# EAGLE design Rectangular_Touch_Pad_V2.3 (EAGLE 9.5.0)
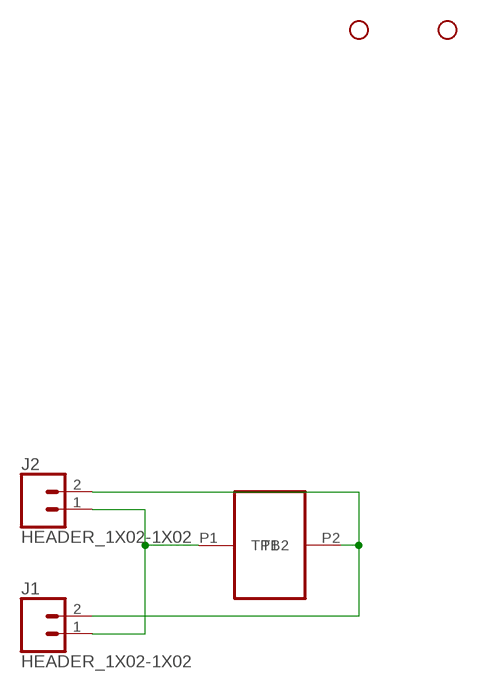
[diagram p0: schematic, sheet 1]

## Parts
H1  STAND-OFF-  [STAND-OFF]
H2  STAND-OFF-  [STAND-OFF]
J1  HEADER_1X02-1X02  [1X02]
J2  HEADER_1X02-1X02  [1X02]
U$1  TOUCHPAD-VER2.3  [TOUCHPAD-RECT-VER2.3]

## Nets
N$1: J1.1 J2.1 U$1.P1(TP1)
N$4: J1.2 J2.2 U$1.P2(TB2)

## Library data of the parts
H1 H2 = MMC Eagle:STAND-OFF-
J1 J2 = MMC Eagle:HEADER_1X02-
U$1 = MMC Eagle:TOUCHPAD-

## Board
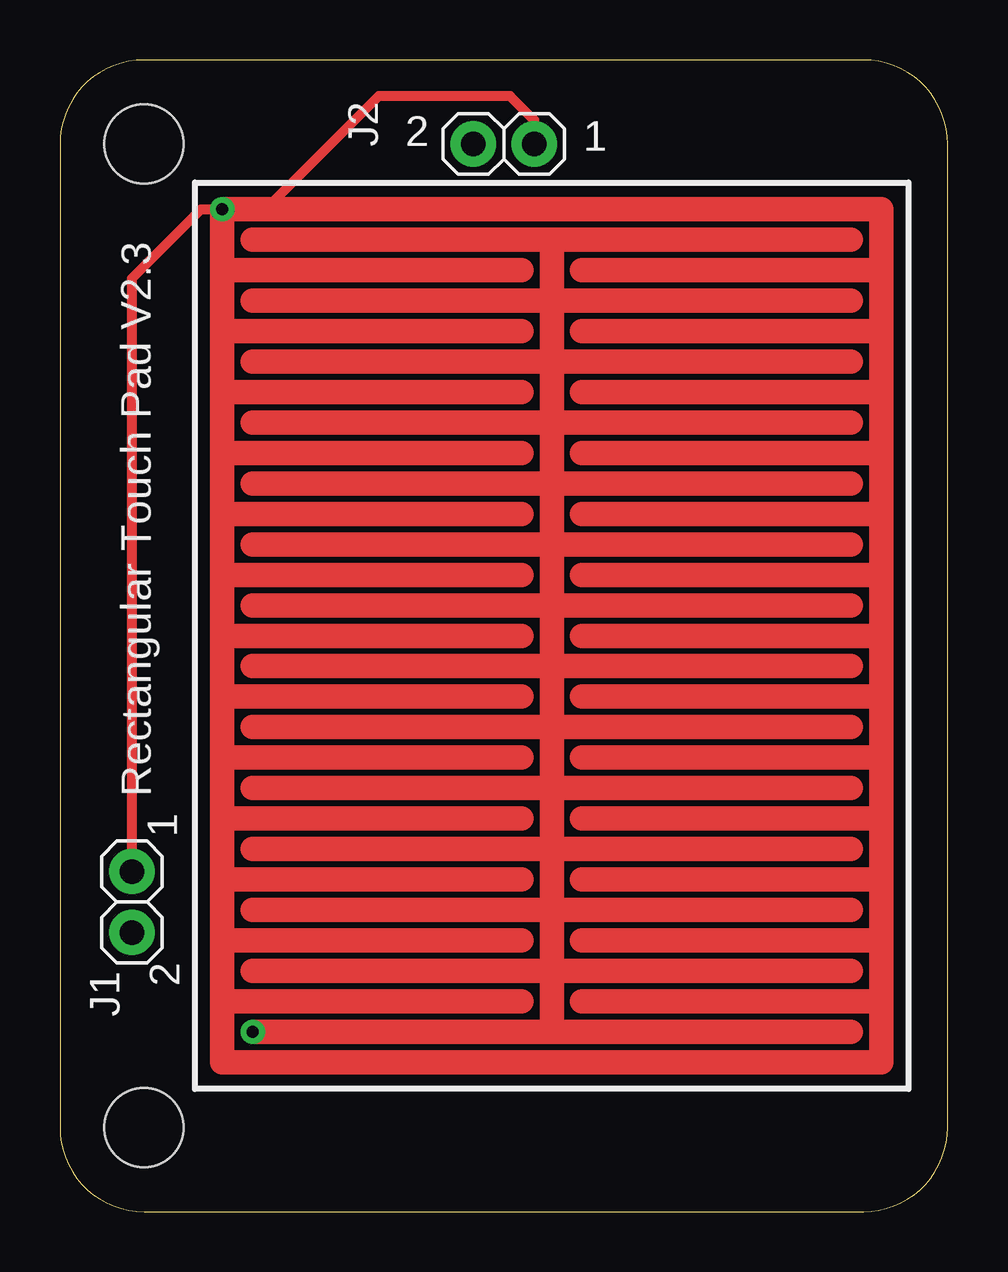
[diagram p1: board, top side]
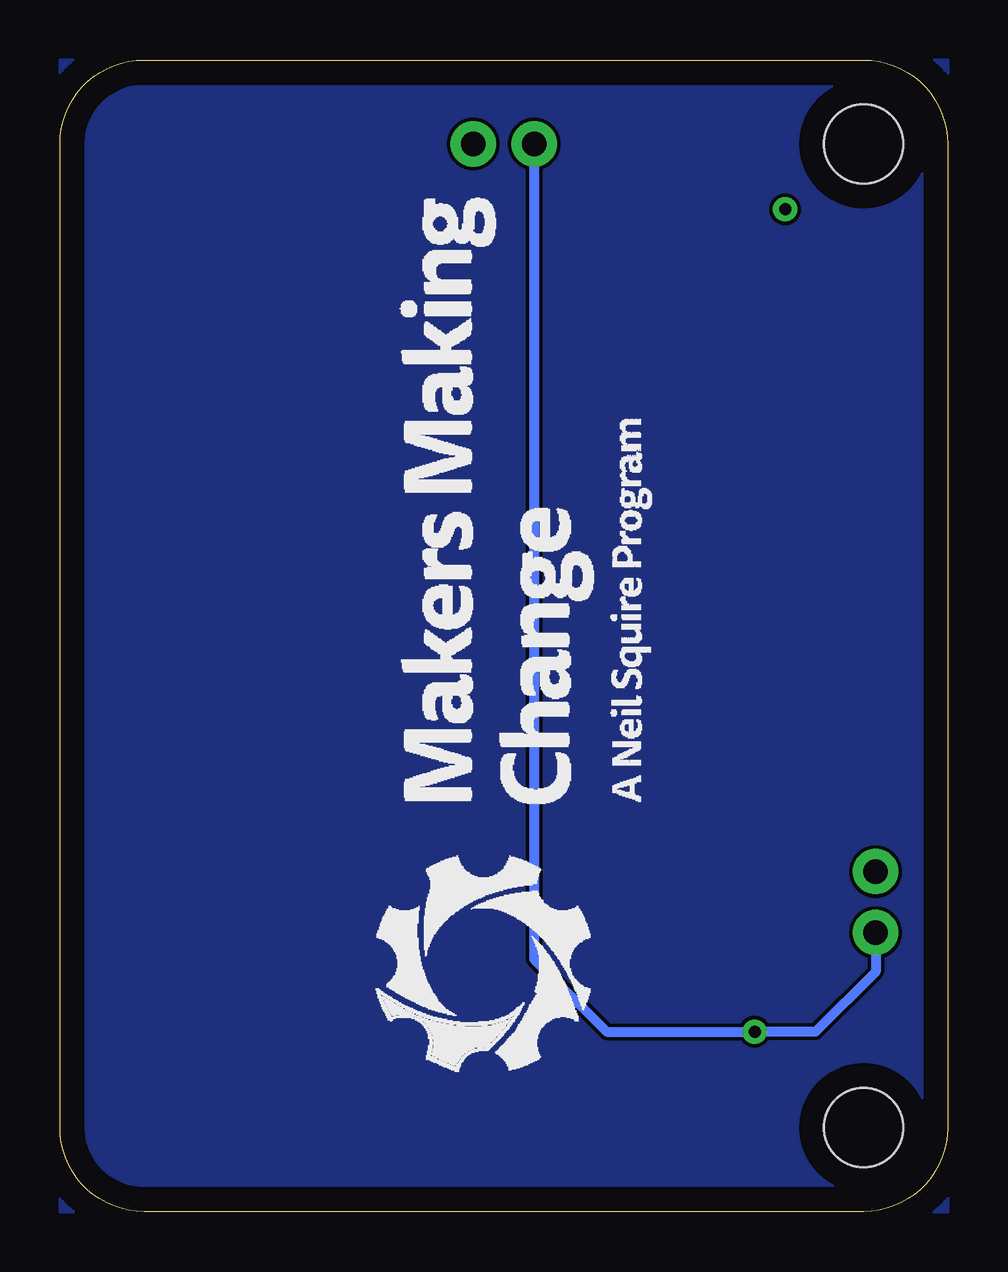
[diagram p2: board, bottom side, seen from below]

Size 37 x 48 mm. Coordinates in mm from the lower left corner, seen from the top.
Outline: 0,3.5 arc90 3.5,0 33.5,0 arc90 37,3.5 37,44.5 arc90 33.5,48 3.5,48 arc90 0,44.5 0,3.5
Copper layers (1*16): Top 0.035mm / dielectric 1.5mm / Bottom 0.035mm
Design rules "default *": minimum track width 6mil, minimum drill 0.45mm, track to track 6mil, track to pad 6mil, pad to pad 6mil, via to via 6mil, smd to smd 6mil, copper to edge 40mil, drill to drill 6mil, minimum pad ring 10mil, minimum via ring 8mil, stop-mask expansion 4mil, vias tented up to drill 0mil, thermal gap 10mil

### Footprints (pad centres in the part's own frame; a part is rotated, then mirrored left to right if it is on the bottom)
STAND-OFF = hole 3.302: 0,0
1X02 = drill 1.016 pad 1.88: 1 -1.27,0; 2 1.27,0
TOUCHPAD-RECT-VER2.3 = drill 0.5: P1 -13.73,17.78; P2 -12.46,-16.51

### Placement (x,y rotation side)
H1  3.5,3.5 0 top
H2  3.5,44.5 0 top
J1  3,12.9 270 top
J2  18.5,44.5 180 top
U$1  20.5,24 0 top

### Tracks (layer width: path | path; a pad name or v marks a point on that pad's centre or on a via)
GND
  pour Bottom: 0,0 0,48 37,48 37,0
N$1
  Top 0.406: J2.1 19.77,45.5 18.77,46.5 13.29,46.5 8.57,41.78 U$1.P1 5.88,41.78 3,38.9 J1.1
N$4
  Bottom 0.406: J1.2 3,10 5.51,7.49 U$1.P2 14.2,7.49 17.23,10.52 J2.2

### Text on the board
tNames: 2 | 1 | Rectangular Touch Pad V2.3 | 1 | 2